# Altium project LMP91000 BLE.PrjPcb
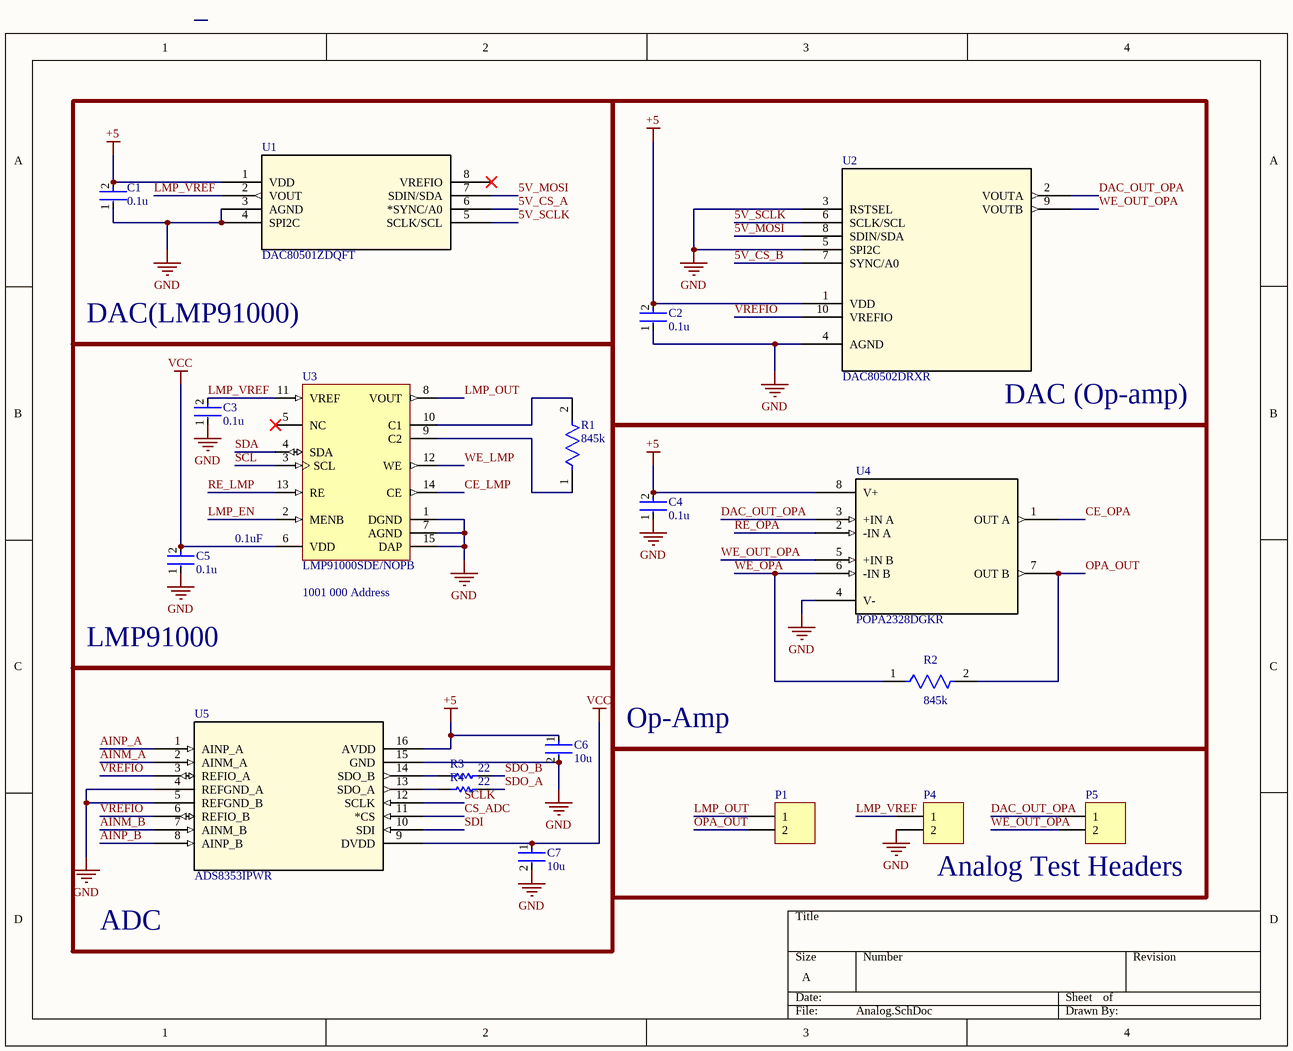
[diagram p0: Analog.SchDoc]
4 sheets, 58 parts. Net scope: global (net labels, ports and power ports of the same name join across sheets).
Board file: LMP91000 BLE.PcbDoc
Sheets:
  Analog.SchDoc
  MCU.SchDoc
  Power.SchDoc
  ADC Driver.SchDoc

## Sheet Analog.SchDoc
size A; SheetNumber: 1; SheetTotal: 4

### Parts
C1  0.1u  [FP-GCJ188-0_2-IPC_C]
C2  0.1u  [FP-GCJ188-0_2-IPC_C]
C3  0.1u  [FP-GCJ188-0_2-IPC_C]
C4  0.1u  [FP-GCJ188-0_2-IPC_C]
C5  0.1u  [FP-GCJ188-0_2-IPC_C]
C6  10u  [FP-CL21-IPC_C]
C7  10u  [FP-CL21-IPC_C]
P1  Header 2  [My_1X02]  (value not drawn)
P4  Header 2  [My_1X02]  (value not drawn)
P5  Header 2  [My_1X02]  (value not drawn)
R1  845k  [FP-CR0603-IPC_B]
R2  845k  [FP-CR0603-IPC_B]
R3  22  [RESC1608X55X25LL10T15]
R4  22  [RESC1608X55X25LL10T15]
U1  DAC80501ZDQFT  [WSON8_2P1X2P1_TEX]
U2  DAC80502DRXR  [SON_02DRXR_TEX]
U3  LMP91000SDE/NOPB  [NHL0014B_V]
U4  POPA2328DGKR  [SO8_DGK_TEX]
U5  ADS8353IPWR  [PW16_TEX]

### Blocks framed on the sheet
DAC(LMP91000): C1 U1
DAC (Op-amp): C2 U2
LMP91000: C3 C5 R1 U3
Op-Amp: C4 R2 U4

### Nets
+5: C1.2 C2.2 C4.2 C6.1 U1.1(VDD) U2.1(VDD) U4.8(V+) U5.16(AVDD)
GND: C1.1 C2.1 C3.1 C4.1 C5.1 C6.2 C7.2 P4.2 U1.3(AGND) U1.4(SPI2C) U2.3(RSTSEL) U2.4(AGND) U2.5(SPI2C) U3.1(DGND) U3.7(AGND) U3.15(DAP) U4.4(V-) U5.4(REFGND_A) U5.5(REFGND_B) U5.15(GND)
VCC: C5.2 C7.1 U3.6(VDD) U5.9(DVDD)
5V_CS_A: U1.6(*SYNC/A0)
5V_CS_B: U2.7(SYNC/A0)
5V_MOSI: U1.7(SDIN/SDA) U2.8(SDIN/SDA)
5V_SCLK: U1.5(SCLK/SCL) U2.6(SCLK/SCL)
AINM_A: U5.2(AINM_A)
AINM_B: U5.7(AINM_B)
AINP_A: U5.1(AINP_A)
AINP_B: U5.8(AINP_B)
CE_LMP: U3.14(CE)
CE_OPA: U4.1(OUT_A)
CS_ADC: U5.11(*CS)
DAC_OUT_OPA: P5.1 U2.2(VOUTA) U4.3(+IN_A)
LMP_EN: U3.2(MENB)
LMP_OUT: P1.1 U3.8(VOUT)
LMP_VREF: C3.2 P4.1 U1.2(VOUT) U3.11(VREF)
OPA_OUT: P1.2 R2.2 U4.7(OUT_B)
RE_LMP: U3.13(RE)
RE_OPA: U4.2(-IN_A)
SCL: U3.3(SCL)
SCLK: U5.12(SCLK)
SDA: U3.4(SDA)
SDI: U5.10(SDI)
SDO_A: R4.2
SDO_B: R3.2
VREFIO: U2.10(VREFIO) U5.3(REFIO_A) U5.6(REFIO_B)
WE_LMP: U3.12(WE)
WE_OPA: R2.1 U4.6(-IN_B)
WE_OUT_OPA: P5.2 U2.9(VOUTB) U4.5(+IN_B)
NetR1_1: R1.1 U3.9(C2)
NetR1_2: R1.2 U3.10(C1)
NetR3_1: R3.1 U5.14(SDO_B)
NetR4_1: R4.1 U5.13(SDO_A)

Not connected (* = marked no-connect by the designer): U1 8(VREFIO)*; U3 5(NC)*

### Notes on the sheet
- 0.1uF
- (near U3) 1001 000 Address
- ADC
- Analog Test Headers

### Library data of the parts
C1-C5 = CMP-2006-02223-2: Cap Ceramic 0.1uF 50V X7R 10% Pad SMD 0603 Soft Termination +125°C Automotive T/R; Capacitance: 100nF; Radiation Hardening: No; Dielectric: X7R; Voltage Rating (DC): 50V; Case Code (Imperial): 0603; Length: 1.6mm; Features: Soft Termination; Case Code (Metric): 1608; Case/Package: 0603; Termination: SMD/SMT; Packaging: Tape and Reel; Height: 0.8mm; Tolerance: 10%; Thickness: 0.035inch; Width: 0.031inch; Voltage Rating: 50V; Min Operating Temperature: -55°C; Ratings: AEC-Q200; Package Quantity: 1; Depth: 0.8mm; Mount: Surface Mount; Lead Free: Lead Free; Max Operating Temperature: 125°C
C6 C7 = CMP-13271-001427-1: CL21 Series 0805 10uF 6.3V ±10% Tolerance X7R Multilayer Ceramic Chip Capacitor; Min Operating Temperature: -55°C; Capacitance: 10uF; Dielectric: X7R; Voltage Rating: 6.3V; Case/Package: 0805; Height: 1.25mm; Case Code (Metric): 2012; Tolerance: 10%; Packaging: Tape and Reel; Thickness: 0.055inch; Voltage: 6.3V; Max Operating Temperature: 125°C; Lead Free: Lead Free; Package Quantity: 3000; Case Code (Imperial): 0805; Depth: 1.25mm; Width: 0.049inch; Length: 2mm; Mount: Surface Mount
P1 P4 P5 = Header 2: Header, 2-Pin; ASiD Part Number: Header 2-AS
R1 R2 = CMP-07231-001938-1: Thick Film Chip Resistors 0603 845kΩ 0.1W 1% 100ppm/°C; Voltage Rating: 50V; Power Rating: 100mW; Resistance: 845kR; Contact Plating: Tin; Case/Package: 0603; Tolerance: 1%; Case Code (Metric): 1608; Termination: SMD/SMT; Min Operating Temperature: -55°C; Depth: 0.8mm; Mount: Surface Mount; Max Operating Temperature: 155°C; Thickness: 457um; Military Standard: Not; Height: 0.45mm; Radiation Hardening: No; Length: 1.6mm; Temperature Coefficient: 100ppm/°C; Case Code (Imperial): 0603; Package Quantity: 5000; Width: 0.8mm; Composition: Thick Film; Packaging: Tape and Reel
R3 R4 = CMP-2000-04180-1: Manufacturer: Yageo; Part Number: RC0603FR-1022RL
U1 = DAC80501ZDQFT: True 16-bit, 1-ch, SPI/I2C, voltage-output DAC in WSON package with precision internal reference; Mfr_Name: Texas Instruments; RefDes: RefDes; Type: Type; Supplier 1: Mouser; Supplier Part Number 1: 595-DAC80501ZDQFT
U2 = DAC80502DRXR: Dual-channel, 1-LSB INL, 16-bit, SPI voltage-output digital-to-analog converter (DAC); Mfr_Name: Texas Instruments; RefDes: RefDes; Type: Type; Supplier 1: Digikey; Supplier Part Number 1: 296-DAC80502DRXTCT-ND
U3 = CMP-0064-00201-2: Configurable AFE Potentiostat for Low-Power Chemical Sensing Applications, 14-pin LLP, 250 Reel; Manufacturer: Texas Instruments; PowerWise: N; PackageTopMarking: NS*UZXYTT*L91000; CompType: OtherParts; PackageDescription: LLP, Plastic, Dual, 4 x 4 x 0.8mm Body, 14 Lead, 0.5mm Pitch, No Pullback; ComponentLink1URL: http://www.ti.com/general/docs/lit/getliterature.tsp?genericPartNumber=LMP91000&fileType=pdf; ComponentLink1Description: Datasheet URL; PinCount: 14; RoHS: Y; PackageReference: NHL0014B
U4 = POPA2328DGKR: Dual-channel, precision, 50-µV offset voltage, 40-MHz wide-bandwidth RRIO CMOS op amp; Mfr_Name: Texas Instruments; RefDes: RefDes; Type: Type; Supplier 1: Mouser; Supplier Part Number 1: 595-OPA2328DGKR
U5 = ADS8353IPWR: 16-bit 600-kSPS 2-channel simultaneous-sampling SAR ADC with single-ended inputs; Mfr_Name: Texas Instruments; RefDes: RefDes; Type: Type; Supplier 1: Mouser; Supplier Part Number 1: 595-ADS8353IPWR

## Sheet MCU.SchDoc
size A; SheetNumber: 2; SheetTotal: 4
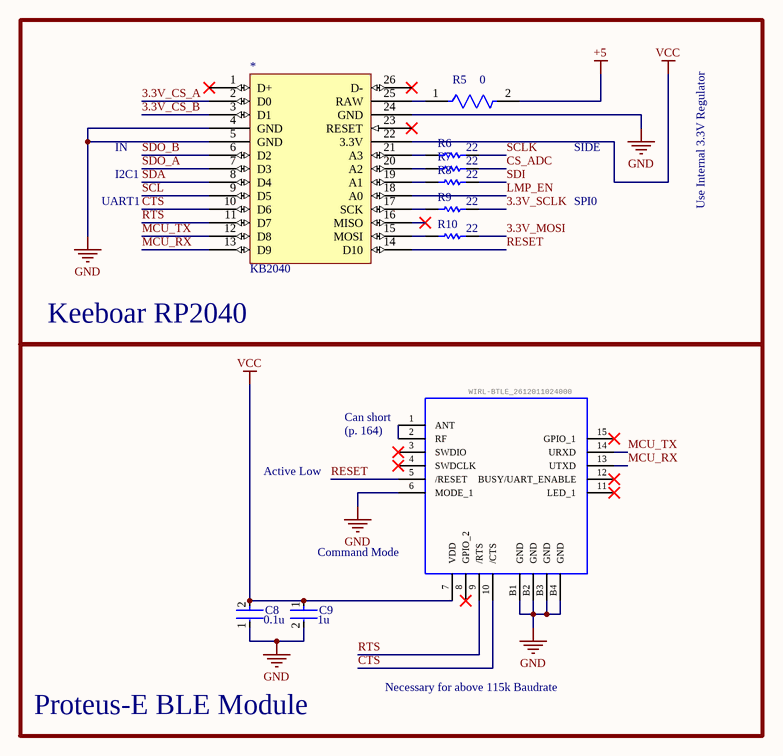
[diagram p1: MCU.SchDoc]

### Parts
*  KB2040  [CAC-254P3300X1775-26N]
?  WIRL-BTLE_2612011024000  [WE-FP-6]
C8  0.1u  [FP-GCJ188-0_2-IPC_C]
C9  1u  [FP-GCM188-0_1-IPC_B]
R5  0  [FP-CRCW0603-MFG]
R6  22  [RESC1608X55X25LL10T15]
R7  22  [RESC1608X55X25LL10T15]
R8  22  [RESC1608X55X25LL10T15]
R9  22  [RESC1608X55X25LL10T15]
R10  22  [RESC1608X55X25LL10T15]

### Blocks framed on the sheet
Keeboar RP2040: * R5-R10
Proteus-E BLE Module: ? C8 C9

### Nets
+5: R5.2
GND: *.4(GND) *.5(GND) *.24(GND) ?.6(MODE_1) ?.B1(GND) ?.B2(GND) ?.B3(GND) ?.B4(GND) C8.1 C9.2
VCC: *.22(3.3V) ?.7(VDD) C8.2 C9.1
3.3V_CS_A: *.2(D0)
3.3V_CS_B: *.3(D1)
3.3V_MOSI: R10.2
3.3V_SCLK: R9.2
CS_ADC: R7.2
CTS: *.10(D6) ?.10(/CTS)
LMP_EN: *.18(A0)
MCU_RX: *.13(D9) ?.13(UTXD)
MCU_TX: *.12(D8) ?.14(URXD)
RESET: *.14(D10) ?.5(/RESET)
RTS: *.11(D7) ?.9(/RTS)
SCL: *.9(D5)
SCLK: R6.2
SDA: *.8(D4)
SDI: R8.2
SDO_A: *.7(D3)
SDO_B: *.6(D2)
Net*_15: *.15(MOSI) R10.1
Net*_17: *.17(SCK) R9.1
Net*_19: *.19(A1) R8.1
Net*_20: *.20(A2) R7.1
Net*_21: *.21(A3) R6.1
Net*_25: *.25(RAW) R5.1
Net?_1: ?.1(ANT) ?.2(RF)

Not connected (* = marked no-connect by the designer): * 1(D+)* 16(MISO)* 23(RESET)* 26(D-)*; ? 3(SWDIO)* 4(SWDCLK)* 8(GPIO_2)* 11(LED_1)* 12(BUSY/UART_ENABLE)* 15(GPIO_1)*

### Notes on the sheet
- IN
- I2C1
- SIDE
- UART1
- SPI0
- Use Internal 3.3V Regulator
- Can short
- (p. 164)
- Active Low
- (near C9) Command Mode
- Necessary for above 115k Baudrate

### Library data of the parts
* = KB2040-3: Adafruit KB2040 - RP2040 Kee Boar Driver; Adafruit Link: https://www.adafruit.com/product/5302#technical-details
? = WIRL-BTLE_2612011024000: Proteus-e Bluetooth® LE 5.1 Module; RX sensitivity e.r.p: -85; Line of Sight: 350m; Frequency: 2402-2480MHz; Output Power e.r.p: -4dBm; Operating Supply Voltage max.: 3.6V; Operating Supply Voltage min.: 1.8V; Part Number: 2612011024000; Published Date: Jan 2022; Publisher: Würth Elektronik; Operating Temperature: -40 to +85degC; Mounting technology: SMT; Packaging: Tape and reel; ComponentLink1Description: Manufacturer; ComponentLink1URL: http://www.we-online.de; ComponentLink2Description: Datasheet; ComponentLink2URL: https://katalog.we-online.de/wco/datasheet/2612011024000.pdf; Supplier 1: Digikey; Supplier Part Number 1: 732-2612011024000CT-ND
C8 = CMP-2006-02223-2: as C1 on sheet Analog; Radiation Hardening: No; Dielectric: X7R; Voltage Rating (DC): 50V; Case Code (Imperial): 0603; Length: 1.6mm; Features: Soft Termination; Case Code (Metric): 1608; Case/Package: 0603; Termination: SMD/SMT; Packaging: Tape and Reel; Height: 0.8mm; Tolerance: 10%; Thickness: 0.035inch; Width: 0.031inch; Voltage Rating: 50V; Min Operating Temperature: -55°C; Ratings: AEC-Q200; Package Quantity: 1; Depth: 0.8mm; Mount: Surface Mount; Lead Free: Lead Free; Max Operating Temperature: 125°C
C9 = CMP-2006-02357-2: Ceramic Capacitor for Automotive 1uF  ±10% 16VDC X7R 0603 Paper T/R; Voltage: 16V; Thickness: 0.035inch; Width: 0.031inch; Radiation Hardening: No; Depth: 0.8mm; Max Operating Temperature: 125°C; Package Quantity: 1; Ratings: AEC-Q200; Min Operating Temperature: -55°C; Packaging: Tape and Reel; Case Code (Metric): 1608; REACH SVHC: No SVHC; Dielectric: X7R; Case Code (Imperial): 0603; Length: 1.6mm; Height: 0.8mm; Voltage Rating: 16V; Termination: SMD/SMT; Case/Package: 0603; Voltage Rating (DC): 16V; Tolerance: 10%; Capacitance: 1uF; Mount: Surface Mount; Lead Free: Lead Free
R5 = CMP-02407-011577-1: RES SMD 0 OHM JUMPER 1/10W 0603; Resistance: 0R; Tolerance: 5%; Power Dissipation: 100mW; Voltage Rating (DC): 75V; Temperature Coefficient: 100ppm/°C; Min Operating Temperature: -55°C; RoHS Compliant: No; Military Standard: Not; Case Code (Imperial): 0603; Series: CRCW; Resistor Type: Thick Film; Features: Automotive AEC-Q200; Power Rating: 100mW; Radiation Hardening: No; Case/Package: 0603; Width: 0.033inch; Length: 1.55mm; Case Code (Metric): 1608; Depth: 0.85mm; Package Quantity: 5000; Size Code: 0603; Weight: 7.1E-05oz; Termination: SMD/SMT; Lead Free: Contains Lead; Packaging: Tape and Reel; Contact Plating: Tin; Max Operating Temperature: 155°C; Number of Terminations: 2; Max Power Dissipation: 100mW; Construction: Rectangular; Mount: Surface Mount; Height: 0.02inch; Voltage Rating: 75V
R6-R10 = CMP-2000-04180-1: as R3 on sheet Analog

## Sheet Power.SchDoc
size A; SheetNumber: 3; SheetTotal: 4
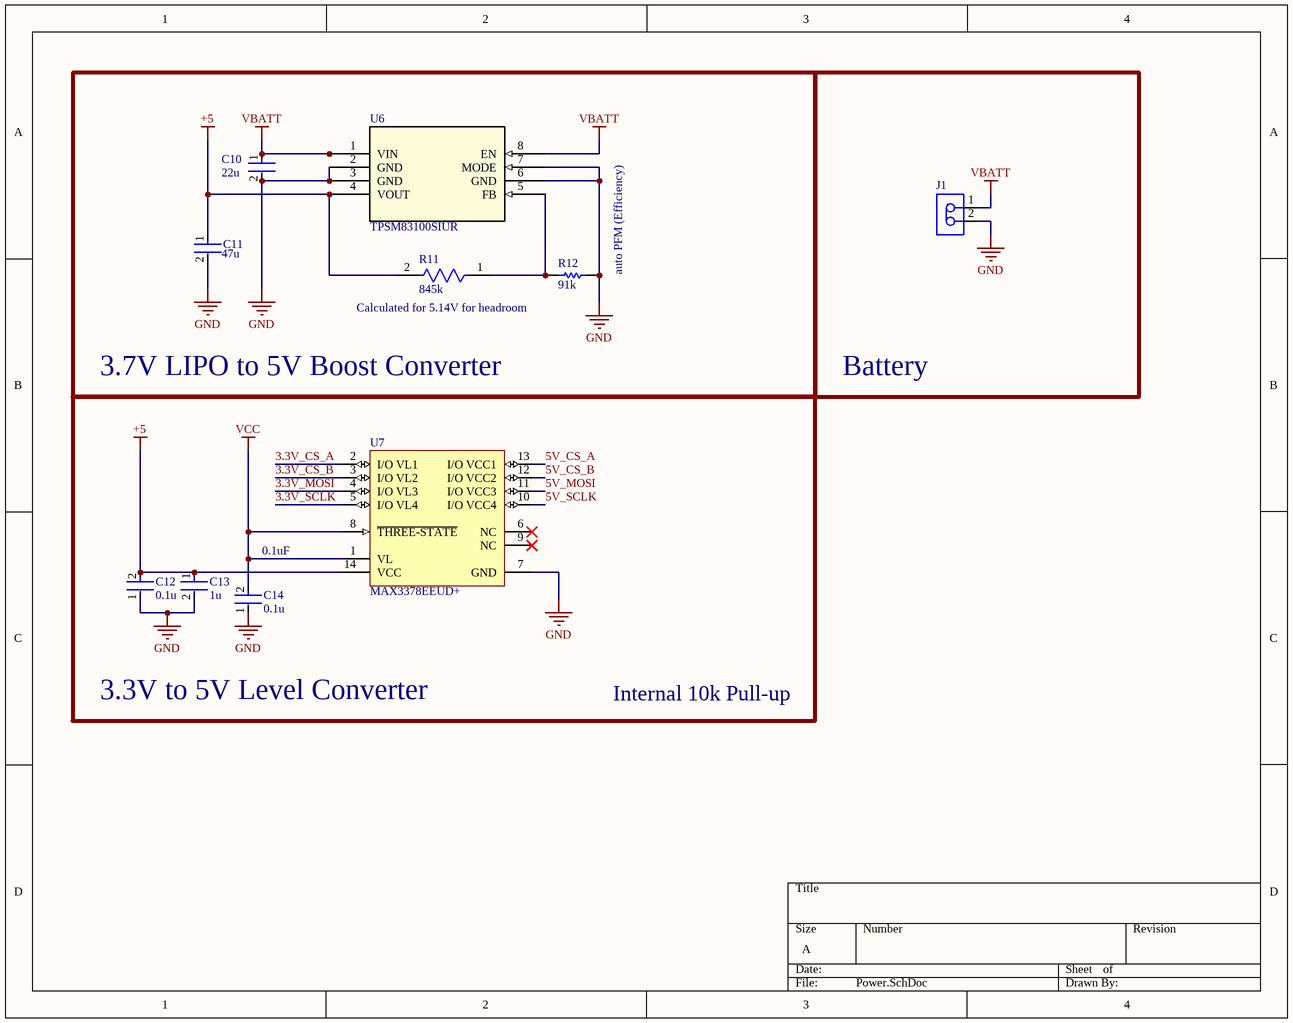
[diagram p2: Power.SchDoc]

### Parts
C10  22u  [FP-GRM187-0_2-IPC_C]
C11  47u  [FP-GRM219-0_2-0_1-IPC_A]
C12  0.1u  [FP-GCJ188-0_2-IPC_C]
C13  1u  [FP-GCM188-0_1-IPC_B]
C14  0.1u  [FP-GCJ188-0_2-IPC_C]
J1  B2B-PH-K-S(LF)(SN)  [JST-B2B-PH-K-S_V]  (value not drawn)
R11  845k  [FP-CR0603-IPC_B]
R12  91k  [RESC1609X50X30NL10T20]
U6  TPSM83100SIUR  [MICROSIP8_SIU_TEX]
U7  MAX3378EEUD+  [MAXM-U14+1_V]

### Blocks framed on the sheet
3.7V LIPO to 5V Boost Converter: C10 C11 R11 R12 U6
Battery: J1
3.3V to 5V Level Converter: C12-C14 U7

### Nets
+5: C11.1 C12.2 C13.1 R11.2 U6.4(VOUT) U7.14(VCC)
GND: C10.2 C11.2 C12.1 C13.2 C14.1 J1.2 R12.1 U6.2(GND) U6.3(GND) U6.6(GND) U6.7(MODE) U7.7(GND)
VBATT: C10.1 J1.1 U6.1(VIN) U6.8(EN)
VCC: C14.2 U7.1(VL) U7.8(~{THREE-STATE})
3.3V_CS_A: U7.2(I/O_VL1)
3.3V_CS_B: U7.3(I/O_VL2)
3.3V_MOSI: U7.4(I/O_VL3)
3.3V_SCLK: U7.5(I/O_VL4)
5V_CS_A: U7.13(I/O_VCC1)
5V_CS_B: U7.12(I/O_VCC2)
5V_MOSI: U7.11(I/O_VCC3)
5V_SCLK: U7.10(I/O_VCC4)
NetR11_1: R11.1 R12.2 U6.5(FB)

Not connected (* = marked no-connect by the designer): U7 6(NC)* 9(NC)*

### Notes on the sheet
- (near R12) auto PFM (Efficiency)
- Calculated for 5.14V for headroom
- (near C14) 0.1uF
- Internal 10k Pull-up

### Library data of the parts
C10 = CMP-06035-049226-1: Chip Multilayer Ceramic Capacitors for General Purpose, 0603, 22uF, X5R, 15%, 20%, 10V; Dielectric: X5R; Capacitance: 22uF; Voltage Rating: 10V; Case/Package: 0603; Case Code (Imperial): 0603; Voltage Rating (DC): 10V; Mount: Surface Mount; Length: 0.063inch; Width: 0.031inch; Max Operating Temperature: 85°C; Thickness: 0.031inch; Tolerance: 20%; Case Code (Metric): 1608; Packaging: Tape and Reel; Min Operating Temperature: -55°C
C11 = CMP-06035-004086-1: Chip Multilayer Ceramic Capacitors for General Purpose, 0805, 47uF, X5R, 15%, 20%, 6.3V; Case Code (Metric): 2012; Voltage Rating: 6.3V; Case Code (Imperial): 0805; Max Operating Temperature: 85°C; Width: 0.049inch; Length: 0.079inch; Min Operating Temperature: -55°C; Mount: Surface Mount; Packaging: Tape and Reel; Case/Package: 0805; Thickness: 0.037inch; Capacitance: 47uF; Tolerance: 20%
C12 C14 = CMP-2006-02223-2: as C1 on sheet Analog; Radiation Hardening: No; Dielectric: X7R; Voltage Rating (DC): 50V; Case Code (Imperial): 0603; Length: 1.6mm; Features: Soft Termination; Case Code (Metric): 1608; Case/Package: 0603; Termination: SMD/SMT; Packaging: Tape and Reel; Height: 0.8mm; Tolerance: 10%; Thickness: 0.035inch; Width: 0.031inch; Voltage Rating: 50V; Min Operating Temperature: -55°C; Ratings: AEC-Q200; Package Quantity: 1; Depth: 0.8mm; Mount: Surface Mount; Lead Free: Lead Free; Max Operating Temperature: 125°C
C13 = CMP-2006-02357-2: as C9 on sheet MCU; Thickness: 0.035inch; Width: 0.031inch; Radiation Hardening: No; Depth: 0.8mm; Max Operating Temperature: 125°C; Package Quantity: 1; Ratings: AEC-Q200; Min Operating Temperature: -55°C; Packaging: Tape and Reel; Case Code (Metric): 1608; REACH SVHC: No SVHC; Dielectric: X7R; Case Code (Imperial): 0603; Length: 1.6mm; Height: 0.8mm; Voltage Rating: 16V; Termination: SMD/SMT; Case/Package: 0603; Voltage Rating (DC): 16V; Tolerance: 10%; Capacitance: 1uF; Mount: Surface Mount; Lead Free: Lead Free
J1 = CMP-2000-05162-1: Male Header, Pitch 2 mm, 1 x 2 Position, Height 6 mm, Tail Length 3.4 mm, -25 to 85 degC, RoHS, Bulk; Manufacturer: JST; Pitch: 2mm; Style/Orientation: StraightHeader/Plug; No of Positions: 2; Datasheet Version: Nov-08; Datasheet URL: http://datasheet.octopart.com/B2B-PH-K-S%28LF%29%28SN%29-JST-datasheet-8324864.pdf; Manufacturer URL: http://www.jst.com/home2.html; Type: ShroudedHeader; Termination: Crimp
R11 = CMP-07231-001938-1: as R1 on sheet Analog; Contact Plating: Tin; Case/Package: 0603; Tolerance: 1%; Case Code (Metric): 1608; Termination: SMD/SMT; Min Operating Temperature: -55°C; Depth: 0.8mm; Mount: Surface Mount; Max Operating Temperature: 155°C; Thickness: 457um; Military Standard: Not; Height: 0.45mm; Radiation Hardening: No; Length: 1.6mm; Temperature Coefficient: 100ppm/°C; Case Code (Imperial): 0603; Package Quantity: 5000; Width: 0.8mm; Composition: Thick Film; Packaging: Tape and Reel
R12 = CMP-2000-03640-1: Part Number: CRCW060391K0FKEA; Manufacturer: Vishay Dale
U6 = TPSM83100SIUR: 1.5-A high efficiency buck-boost module with integrated inductor; Mfr_Name: Texas Instruments; Type: Power Management; RefDes: RefDes; Supplier 1: Mouser; Supplier Part Number 1: 595-TPSM83100SIUR
U7 = CMP-1703-00001-3: +/-15 kV ESD-Protected, 1 uA, 8 Mbps, Quad Low-Voltage Level Translator in UCSP, 1.65 to 5.5 V, -40 to 85 degC, 14-Pin TSSOP (U14+1), RoHS, Tube; Channels: 4; Min Supply Voltage: 1.65 V; Max Supply Voltage: 5.5 V; Max Ouput Current: -20 uA; Output Current: 1 mA; Case/Package: TSSOP; DatasheetVersion: Rev. 3; Inputs: 4; Max Operating Temperature: 85 degC; ComponentLink3URL: http://pdfserv.maximintegrated.com/package_dwgs/21-0066.PDF; Mount: Surface Mount; Weight: 0.004949 oz; Code_JEDEC: MO-153; ComponentLink3Description: Package Specification; Packaging: Rail/Tube; Pins: 14; REACH SVHC: No SVHC; Package Quantity: 96; PartNumber: MAX3378EEUD+; Width: 4.5 mm; ComponentLink1Description: Manufacturer URL; Height: 0.95 mm; ComponentLink2URL: https://datasheets.maximintegrated.com/en/ds/MAX3372E-MAX3393E.pdf; Radiation Hardening: No; Length: 5.1 mm; PackageDescription: 14-Pin Thin Shrink Small-Outline Package (U14+1), Body 5 x 4.4 mm, Pitch 0.65 mm; RoHSCompliant: True; Min Operating Temperature: -40 degC; Mounting Technology: Surface Mount; ComponentLink2Description: Datasheet; ComponentLink1URL: http://www.maximintegrated.com/

## Sheet ADC Driver.SchDoc
size A; SheetNumber: 4; SheetTotal: 4
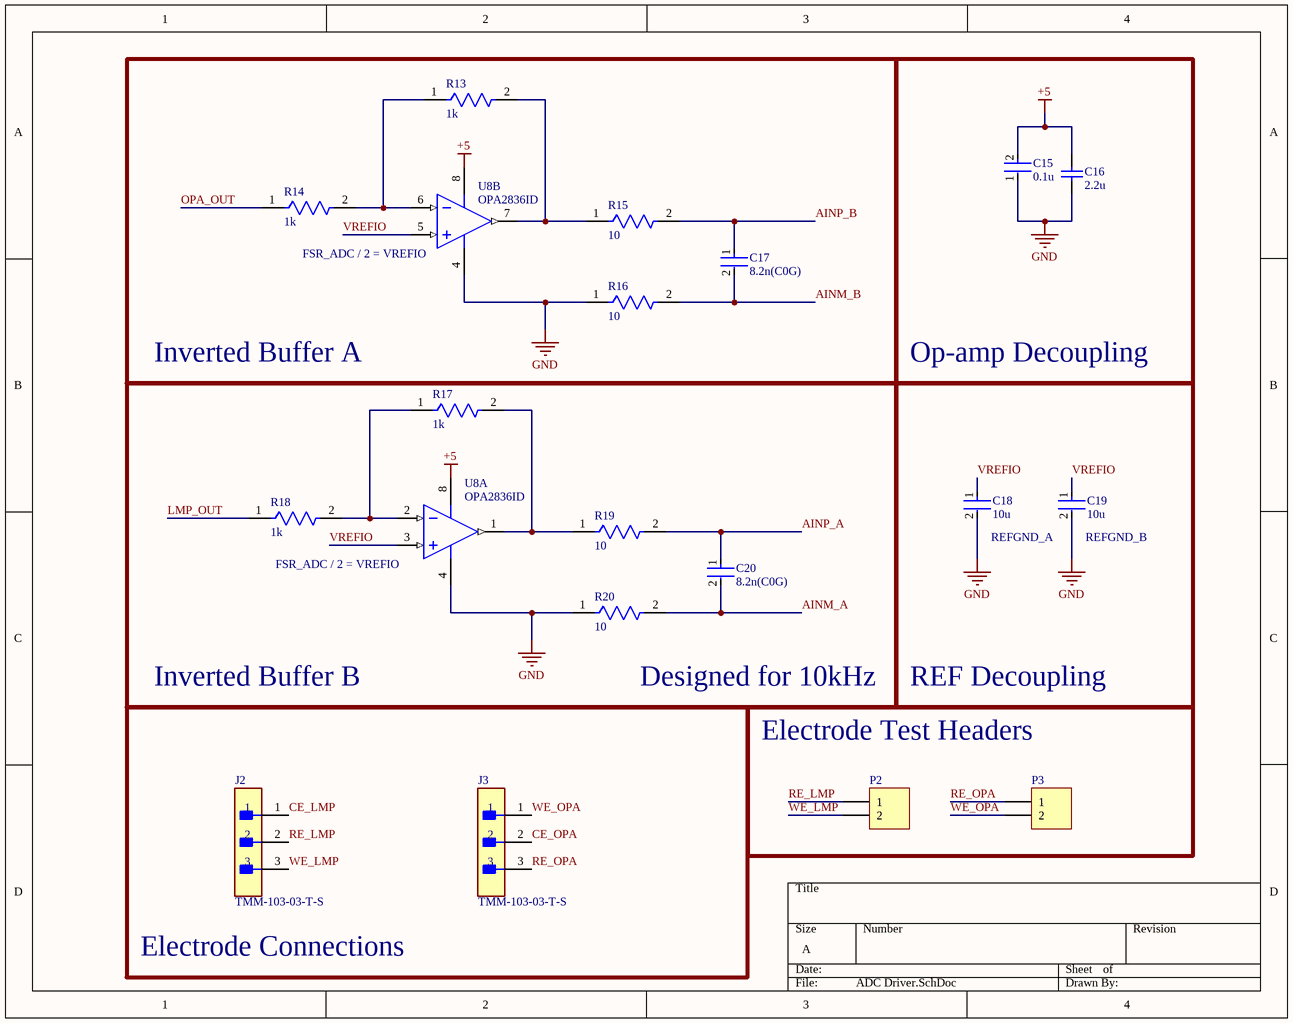
[diagram p3: ADC Driver.SchDoc]

### Parts
C15  0.1u  [FP-GCJ188-0_2-IPC_C]
C16  2.2u  [CAPC0603(1608)100_N]
C17  8.2n(C0G)  [FP-C2012-125-0_2-MFG]
C18  10u  [FP-CL21-IPC_C]
C19  10u  [FP-CL21-IPC_C]
C20  8.2n(C0G)  [FP-C2012-125-0_2-MFG]
J2  TMM-103-03-T-S  [FP-TMM-103-03-T-S-MFG]
J3  TMM-103-03-T-S  [FP-TMM-103-03-T-S-MFG]
P2  Header 2  [My_1X02]  (value not drawn)
P3  Header 2  [My_1X02]  (value not drawn)
R13  1k  [FP-RT0603-MFG]
R14  1k  [FP-RT0603-MFG]
R15  10  [FP-CPF0603-MFG]
R16  10  [FP-CPF0603-MFG]
R17  1k  [FP-RT0603-MFG]
R18  1k  [FP-RT0603-MFG]
R19  10  [FP-CPF0603-MFG]
R20  10  [FP-CPF0603-MFG]
U8  OPA2836ID  [D0008A_L]  (parts A,B of 2)

### Blocks framed on the sheet
Inverted Buffer A: C17 R13-R16 U8
Op-amp Decoupling: C15 C16
REF Decoupling: C18 C19

### Nets
+5: C15.2 C16.2 U8.8(VS+)
GND: C15.1 C16.1 C18.2 C19.2 R16.1 R20.1 U8.4(VS-)
AINM_A: C20.2 R20.2
AINM_B: C17.2 R16.2
AINP_A: C20.1 R19.2
AINP_B: C17.1 R15.2
CE_LMP: J2.1
CE_OPA: J3.2
LMP_OUT: R18.1
OPA_OUT: R14.1
RE_LMP: J2.2 P2.1
RE_OPA: J3.3 P3.1
VREFIO: C18.1 C19.1 U8.3(VIN1+) U8.5(VIN2+)
WE_LMP: J2.3 P2.2
WE_OPA: J3.1 P3.2
NetR13_1: R13.1 R14.2 U8.6(VIN2-)
NetR13_2: R13.2 R15.1 U8.7(VOUT2)
NetR17_1: R17.1 R18.2 U8.2(VIN1-)
NetR17_2: R17.2 R19.1 U8.1(VOUT1)

### Notes on the sheet
- (near U8) FSR_ADC / 2 = VREFIO
- FSR_ADC / 2 = VREFIO
- REFGND_A
- (near C19) REFGND_B
- Inverted Buffer B
- (near R20) Designed for 10kHz
- Electrode Test Headers
- Electrode Connections

### Library data of the parts
C15 = CMP-2006-02223-2: as C1 on sheet Analog; Radiation Hardening: No; Dielectric: X7R; Voltage Rating (DC): 50V; Case Code (Imperial): 0603; Length: 1.6mm; Features: Soft Termination; Case Code (Metric): 1608; Case/Package: 0603; Termination: SMD/SMT; Packaging: Tape and Reel; Height: 0.8mm; Tolerance: 10%; Thickness: 0.035inch; Width: 0.031inch; Voltage Rating: 50V; Min Operating Temperature: -55°C; Ratings: AEC-Q200; Package Quantity: 1; Depth: 0.8mm; Mount: Surface Mount; Lead Free: Lead Free; Max Operating Temperature: 125°C
C16 = CMP-1035-02766-1: CAP 2.2uF 16V -20% to +80% 0603 (1608 Metric) Thickness 1mm SMD; Case-Metric: 1608; Case-EIA: 0603; Value: 2.2uF; Rated Voltage: 16 V; Tolerance: -20% to +80%; Technology: SMT; Max Thickness: 1 mm
C17 C20 = CMP-08246-005878-1: Multilayer Ceramic Capacitors 8.2nF ±5% 250V C0G SMD 0805; Mount: Surface Mount; RoHS Compliant: Yes; Dielectric: C0G; Height: 1.25mm; Thickness: 0.057inch; Tolerance: 5%; Voltage Rating (DC): 250V; Width: 0.049inch; Packaging: Tape and Reel; Capacitance: 8.2nF; Max Operating Temperature: 125°C; Weight: 0.000194oz; Length: 0.079inch; Case Code (Imperial): 0805; Voltage Rating: 250V; Case/Package: 0805; Case Code (Metric): 2012; Min Operating Temperature: -55°C; Package Quantity: 2000; Termination: SMD/SMT
C18 C19 = CMP-13271-001427-1: as C6 on sheet Analog; Min Operating Temperature: -55°C; Capacitance: 10uF; Dielectric: X7R; Voltage Rating: 6.3V; Case/Package: 0805; Height: 1.25mm; Case Code (Metric): 2012; Tolerance: 10%; Packaging: Tape and Reel; Thickness: 0.055inch; Voltage: 6.3V; Max Operating Temperature: 125°C; Lead Free: Lead Free; Package Quantity: 3000; Case Code (Imperial): 0805; Depth: 1.25mm; Width: 0.049inch; Length: 2mm; Mount: Surface Mount
J2 J3 = CMP-02766-001695-1: CONN HEADER VERT 3POS 2MM; Gender: Male; Number of Positions: 3; Max Current Rating: 3.9A; Max Voltage Rating (AC): 500V; Packaging: Bulk; RoHS Compliant: Yes; Mount: Through Hole; Length: 6mm; Contact Type: Male Pin; Package Quantity: 1; Depth: 1.97mm; Contact Material: Bronze; Insulation Material: Polymer; Series: TMM; Contact Plating: Tin; Fastening Type: Pull; Housing Color: Black; Pitch: 2mm; Termination: Solder; Contact Mating Length: 0.157inch; Min Operating Temperature: -55°C; REACH SVHC: No SVHC; Orientation: Straight; Number of Rows: 1; Color: Black; Insulation Color: Black; Connector Type: Header; Radiation Hardening: No; Number of Contacts: 3; Lead Free: Lead Free; Contact Finish - Mating: TIN; Max Operating Temperature: 105°C; Housing Material: Polymer; Contact Shape: Square
P2 P3 = Header 2: as P1 on sheet Analog
R13 R14 R17 R18 = CMP-03412-013082-1: RES SMD 1K OHM 0.1% 1/10W 0603; Manufacturer Part Number: RT0603BRD071KL; Manufacturer: Yageo; Voltage Rating: 75V; Temperature Coefficient: 25ppm/°C; Value: 1kΩ; Power Rating: 0.1W; Temperature Range Low: -55°C; Series: RT; Digikey Description: RES SMD 1K OHM 0.1% 1/10W 0603; Tolerance: 0.1%; Category: Res; RoHS: TRUE; Composition: Thin Film; ComponentLink2Description: Datasheet; Footprint Url: https://www.yageo.com/upload/website/yageo_PYu-R_Mount_10_19050818_343.pdf; Temperature: -55°C to +155°C; ComponentLink2URL: https://www.yageo.com/upload/media/product/productsearch/datasheet/rchip/PYu-RT_1-to-0.01_RoHS_L_11.pdf; Automotive: No; Octopart: https://octopart.com/rt0603brd071kl-yageo-1433776; Device Class L1: Passive Components; Device Class L2: Resistors; Temperature Range High: +155°C; Height: 0.55mm; Device Class L3: Chip SMD Resistors; Lead Free: Yes; Resistance: 1kΩ; Package: RT0603
R15 R16 R19 R20 = CMP-03211-005347-1: RES SMD 10Ω 0.1% 1/16W 0603; Manufacturer: TE Connectivity; Manufacturer Part Number: CPF0603B10RE; Temperature Coefficient: 25ppm/°C; Voltage Rating: 50V; Power Rating: 0.063W; Device Class L2: Resistors; ComponentLink2Description: Datasheet; Temperature Range High: +155°C; Category: Res; Lead Free: Yes; RoHS: TRUE; Package: CPF0603; Automotive: No; Height: 0.55mm; ComponentLink2URL: https://www.te.com/commerce/DocumentDelivery/DDEController?Action=showdoc&DocId=Data+Sheet%7F1773200%7FM%7Fpdf%7FEnglish%7FENG_DS_1773200_M.pdf%7F3-1676481-2; Temperature: -55°C to +155°C; Octopart: https://octopart.com/cpf0603b10re-te+connectivity-22738715; Series: CPF; packaging: 5k Reel; Resistance: 10Ω; octopart_url: https://octopart.com/cpf0603b10re-te+connectivity-22738715; Tolerance: 0.1%; Composition: Thin Film; Value: 10Ω; Temperature Range Low: -55°C; Device Class L1: Passive Components; Device Class L3: Chip SMD Resistors; Ipc Land Pattern Name: RESC15580X45
U8 = CMP-0016-00050-2: Dual, Very Low Power, Rail to Rail Out, Negative Rail In, VFB Operational Amplifier, 2.5 to 5.5 V, -40 to 85 degC, 8-pin SOIC (D8), Green (RoHS & no Sb/Br); Manufacturer: Texas Instruments; Vs(Max)(V): 5.5; Io(Typ)(mA): 50; BW @ Acl(MHz): 205; Vs(Min)(V): 2.5; Iq per channel(Max)(mA): 1; Iib(Max)(nA): 1000; Vn at Flatband(Typ)(nV/rtHz): 4.6; Sub Family: High Output Current Amplifier (>=50mA), High Speed Amplifier (>=50MHz), Low Noise Amp (<=10nV/rtHz), Low Offset Voltage Amplifier (<=500uV), Low Supply Voltage Amplifier (<=2.7V); Vio(Max)(mV): 0.4; 3rd Harmonic(dBc): 105; Settling Time (0.1%)(Typ)(ns): 30; 2nd Harmonic(dBc): 85; Slew Rate(Typ)(V/us): 560; Number of Channels: 2; Mounting Technology: Surface Mount; ComponentLink1URL: http://www.ti.com/; PartNumber: OPA2836ID; ComponentLink1Description: Manufacturer URL; ComponentLink3URL: http://www.ti.com/litv/pdf/msoi002j; PackageVersion: 4040047-3/M, 06/2011; DatasheetVersion: SLOS712D; Acl, min stable gain(V/V): 1; Code_JEDEC: MS-012; ComponentLink2URL: http://www.ti.com/general/docs/lit/getliterature.tsp?genericPartNumber=OPA2836&fileType=pdf; PackageReference: D0008A; ComponentLink3Description: Package Specification; ComponentLink2Description: Datasheet; Eco-Plan: Green (RoHS & no Sb/Br); PackageDescription: 8-Pin Plastic Small Outline, Body 4.9 x 3.9 mm, Pitch 1.27 mm

## Nets that join several sheets
+5: Analog (8 pins), MCU (R5.2), Power (6 pins), ADC Driver (C15.2 C16.2 U8.8)
GND: Analog (20 pins), MCU (10 pins), Power (12 pins), ADC Driver (7 pins)
VCC: Analog (C5.2 C7.1 U3.6 U5.9), MCU (*.22 ?.7 C8.2 C9.1), Power (C14.2 U7.1 U7.8)
3.3V_CS_A: MCU (*.2), Power (U7.2)
3.3V_CS_B: MCU (*.3), Power (U7.3)
3.3V_MOSI: MCU (R10.2), Power (U7.4)
3.3V_SCLK: MCU (R9.2), Power (U7.5)
5V_CS_A: Analog (U1.6), Power (U7.13)
5V_CS_B: Analog (U2.7), Power (U7.12)
5V_MOSI: Analog (U1.7 U2.8), Power (U7.11)
5V_SCLK: Analog (U1.5 U2.6), Power (U7.10)
AINM_A: Analog (U5.2), ADC Driver (C20.2 R20.2)
AINM_B: Analog (U5.7), ADC Driver (C17.2 R16.2)
AINP_A: Analog (U5.1), ADC Driver (C20.1 R19.2)
AINP_B: Analog (U5.8), ADC Driver (C17.1 R15.2)
CE_LMP: Analog (U3.14), ADC Driver (J2.1)
CE_OPA: Analog (U4.1), ADC Driver (J3.2)
CS_ADC: Analog (U5.11), MCU (R7.2)
LMP_EN: Analog (U3.2), MCU (*.18)
LMP_OUT: Analog (P1.1 U3.8), ADC Driver (R18.1)
OPA_OUT: Analog (P1.2 R2.2 U4.7), ADC Driver (R14.1)
RE_LMP: Analog (U3.13), ADC Driver (J2.2 P2.1)
RE_OPA: Analog (U4.2), ADC Driver (J3.3 P3.1)
SCL: Analog (U3.3), MCU (*.9)
SCLK: Analog (U5.12), MCU (R6.2)
SDA: Analog (U3.4), MCU (*.8)
SDI: Analog (U5.10), MCU (R8.2)
SDO_A: Analog (R4.2), MCU (*.7)
SDO_B: Analog (R3.2), MCU (*.6)
VREFIO: Analog (U2.10 U5.3 U5.6), ADC Driver (C18.1 C19.1 U8.3 U8.5)
WE_LMP: Analog (U3.12), ADC Driver (J2.3 P2.2)
WE_OPA: Analog (R2.1 U4.6), ADC Driver (J3.1 P3.2)